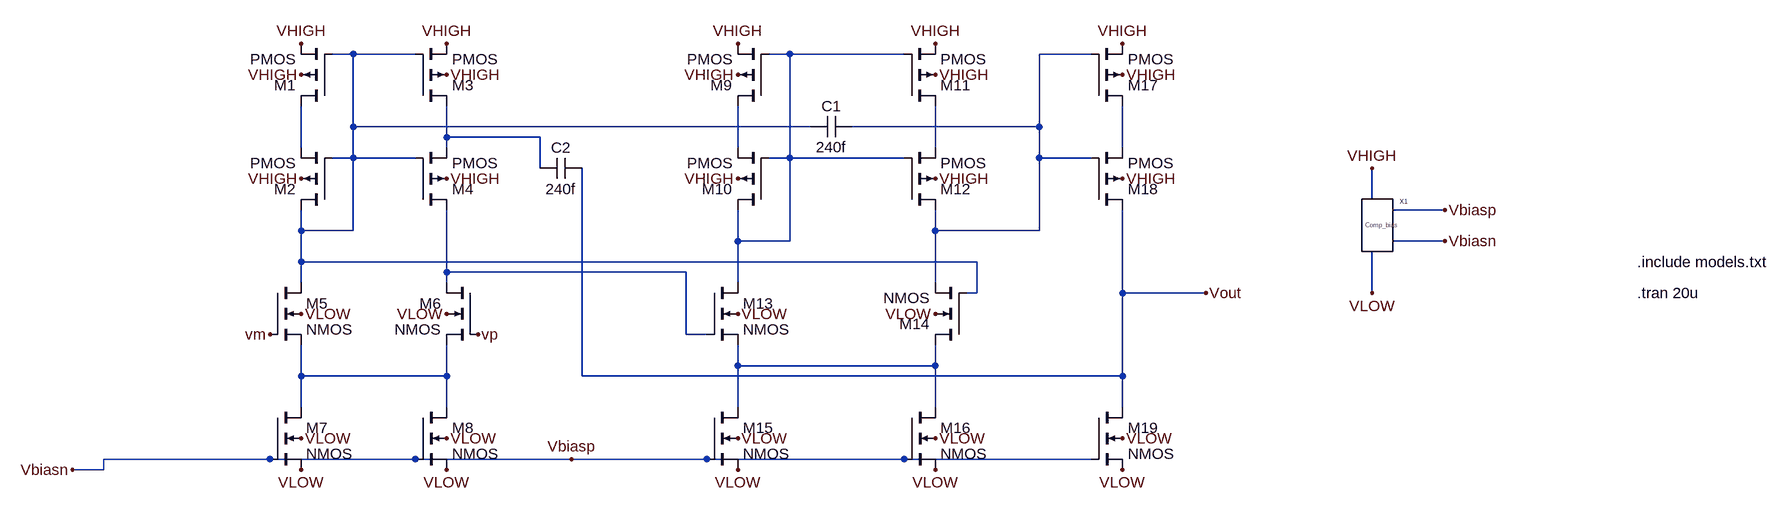
[diagram p0: schematic comparator.asc]
comparator.asc, the LTspice schematic file:
Version 4
SHEET 1 2296 864
WIRE 96 80 64 80
WIRE 192 80 96 80
WIRE 768 80 736 80
WIRE 944 80 768 80
WIRE 1232 80 1152 80
WIRE 96 192 96 80
WIRE 800 192 96 192
WIRE 1152 192 1152 80
WIRE 1152 192 864 192
WIRE 240 208 240 160
WIRE 384 208 240 208
WIRE 16 224 16 160
WIRE 240 224 240 208
WIRE 688 224 688 160
WIRE 992 224 992 160
WIRE 1280 224 1280 160
WIRE 96 240 96 192
WIRE 96 240 64 240
WIRE 192 240 96 240
WIRE 768 240 768 80
WIRE 768 240 736 240
WIRE 944 240 768 240
WIRE 1152 240 1152 192
WIRE 1232 240 1152 240
WIRE 384 256 384 208
WIRE 1664 304 1664 256
WIRE 1776 320 1696 320
WIRE 16 352 16 320
WIRE 96 352 96 240
WIRE 96 352 16 352
WIRE 992 352 992 320
WIRE 1152 352 1152 240
WIRE 1152 352 992 352
WIRE 688 368 688 320
WIRE 768 368 768 240
WIRE 768 368 688 368
WIRE 1776 368 1696 368
WIRE 16 400 16 352
WIRE 1056 400 16 400
WIRE 240 416 240 320
WIRE 608 416 240 416
WIRE 16 432 16 400
WIRE 240 432 240 416
WIRE 688 432 688 368
WIRE 992 432 992 352
WIRE 1056 448 1056 400
WIRE 1056 448 1040 448
WIRE 1280 448 1280 320
WIRE 1408 448 1280 448
WIRE 1664 448 1664 384
WIRE 608 512 608 416
WIRE 640 512 608 512
WIRE 688 560 688 528
WIRE 992 560 992 528
WIRE 992 560 688 560
WIRE 16 576 16 528
WIRE 240 576 240 528
WIRE 240 576 16 576
WIRE 448 576 448 256
WIRE 1280 576 1280 448
WIRE 1280 576 448 576
WIRE 16 624 16 576
WIRE 240 624 240 576
WIRE 688 624 688 560
WIRE 992 624 992 560
WIRE 1280 624 1280 576
WIRE -32 704 -288 704
WIRE 192 704 -32 704
WIRE 432 704 192 704
WIRE 640 704 432 704
WIRE 944 704 640 704
WIRE 1232 704 944 704
WIRE -288 720 -288 704
WIRE -288 720 -336 720
FLAG 16 64 VHIGH
FLAG 240 64 VHIGH
FLAG 16 112 VHIGH
FLAG 240 112 VHIGH
FLAG 16 272 VHIGH
FLAG 240 272 VHIGH
FLAG -32 512 vm
FLAG 288 512 vp
FLAG 16 480 VLOW
FLAG 240 480 VLOW
FLAG 16 672 VLOW
FLAG 240 672 VLOW
FLAG 16 720 VLOW
FLAG 240 720 VLOW
FLAG -336 720 Vbiasn
FLAG 688 672 VLOW
FLAG 688 720 VLOW
FLAG 992 720 VLOW
FLAG 992 672 VLOW
FLAG 688 480 VLOW
FLAG 992 480 VLOW
FLAG 688 272 VHIGH
FLAG 992 272 VHIGH
FLAG 992 112 VHIGH
FLAG 688 112 VHIGH
FLAG 688 64 VHIGH
FLAG 992 64 VHIGH
FLAG 1280 720 VLOW
FLAG 1280 672 VLOW
FLAG 1280 272 VHIGH
FLAG 1280 64 VHIGH
FLAG 1280 112 VHIGH
FLAG 1408 448 Vout
FLAG 432 704 Vbiasp
FLAG 1664 256 VHIGH
FLAG 1664 448 VLOW
FLAG 1776 320 Vbiasp
FLAG 1776 368 Vbiasn
SYMBOL pmos4 64 160 R180
SYMATTR InstName M1
SYMATTR Value2 l=50n w=5u
SYMBOL pmos4 64 320 R180
SYMATTR InstName M2
SYMATTR Value2 l=50n w=5u
SYMBOL pmos4 192 160 M180
SYMATTR InstName M3
SYMATTR Value2 l=50n w=5u
SYMBOL pmos4 192 320 M180
SYMATTR InstName M4
SYMATTR Value2 l=50n w=5u
SYMBOL nmos4 -32 432 R0
SYMATTR InstName M5
SYMATTR Value2 l=100n w=2.5u
SYMBOL nmos4 288 432 M0
SYMATTR InstName M6
SYMATTR Value2 l=100n w=2.5u
SYMBOL nmos4 -32 624 R0
SYMATTR InstName M7
SYMATTR Value2 l=100n w=2.5u
SYMBOL nmos4 192 624 R0
SYMATTR InstName M8
SYMATTR Value2 l=100n w=2.5u
SYMBOL pmos4 736 160 R180
SYMATTR InstName M9
SYMATTR Value2 l=50n w=5u
SYMBOL pmos4 736 320 R180
SYMATTR InstName M10
SYMATTR Value2 l=50n w=5u
SYMBOL pmos4 944 160 M180
SYMATTR InstName M11
SYMATTR Value2 l=50n w=5u
SYMBOL pmos4 944 320 M180
SYMATTR InstName M12
SYMATTR Value2 l=50n w=5u
SYMBOL nmos4 640 432 R0
SYMATTR InstName M13
SYMATTR Value2 l=100n w=2.5u
SYMBOL nmos4 1040 528 R180
SYMATTR InstName M14
SYMATTR Value2 l=100n w=2.5u
SYMBOL nmos4 640 624 R0
SYMATTR InstName M15
SYMATTR Value2 l=100n w=2.5u
SYMBOL nmos4 944 624 R0
SYMATTR InstName M16
SYMATTR Value2 l=100n w=2.5u
SYMBOL pmos4 1232 160 M180
SYMATTR InstName M17
SYMATTR Value2 l=50n w=5u
SYMBOL pmos4 1232 320 M180
SYMATTR InstName M18
SYMATTR Value2 l=50n w=5u
SYMBOL nmos4 1232 624 R0
SYMATTR InstName M19
SYMATTR Value2 l=100n w=2.5u
SYMBOL cap 864 176 R90
WINDOW 0 0 32 VBottom 2
WINDOW 3 32 32 VTop 2
SYMATTR InstName C1
SYMATTR Value 240f
SYMBOL cap 448 240 R90
WINDOW 0 0 32 VBottom 2
WINDOW 3 32 32 VTop 2
SYMATTR InstName C2
SYMATTR Value 240f
SYMBOL Comparator_bias 1680 336 R0
SYMATTR InstName X1
TEXT 2072 400 Left 2 !.include models.txt
TEXT 2072 448 Left 2 !.tran 20u

The netlist it stands for:
* comparator.asc
M1 N005 N001 VHIGH VHIGH PMOS l=50n w=5u
M2 N001 N001 N005 VHIGH PMOS l=50n w=5u
M3 N004 N001 VHIGH VHIGH PMOS l=50n w=5u
M4 N009 N001 N004 VHIGH PMOS l=50n w=5u
M5 N001 vm N011 VLOW NMOS l=100n w=2.5u
M6 N009 vp N011 VLOW NMOS l=100n w=2.5u
M7 N011 Vbiasp VLOW VLOW NMOS l=100n w=2.5u
M8 N011 Vbiasp VLOW VLOW NMOS l=100n w=2.5u
M9 N006 N002 VHIGH VHIGH PMOS l=50n w=5u
M10 N002 N002 N006 VHIGH PMOS l=50n w=5u
M11 N007 N002 VHIGH VHIGH PMOS l=50n w=5u
M12 N003 N002 N007 VHIGH PMOS l=50n w=5u
M13 N002 N009 N010 VLOW NMOS l=100n w=2.5u
M14 N010 N001 N003 VLOW NMOS l=100n w=2.5u
M15 N010 Vbiasp VLOW VLOW NMOS l=100n w=2.5u
M16 N010 Vbiasp VLOW VLOW NMOS l=100n w=2.5u
M17 N008 N003 VHIGH VHIGH PMOS l=50n w=5u
M18 Vout N003 N008 VHIGH PMOS l=50n w=5u
M19 Vout Vbiasp VLOW VLOW NMOS l=100n w=2.5u
C1 N003 N001 240f
C2 Vout N004 240f
XX1 VHIGH VLOW Vbiasp Vbiasp Comparator_bias  ; pins VDD GND Vbiasp Vbiasn
.model NMOS NMOS
.model PMOS PMOS
.lib standard.mos
.include models.txt
.tran 20u
.backanno
.end